# EAGLE schematic pe02 (EAGLE 9.6.2)
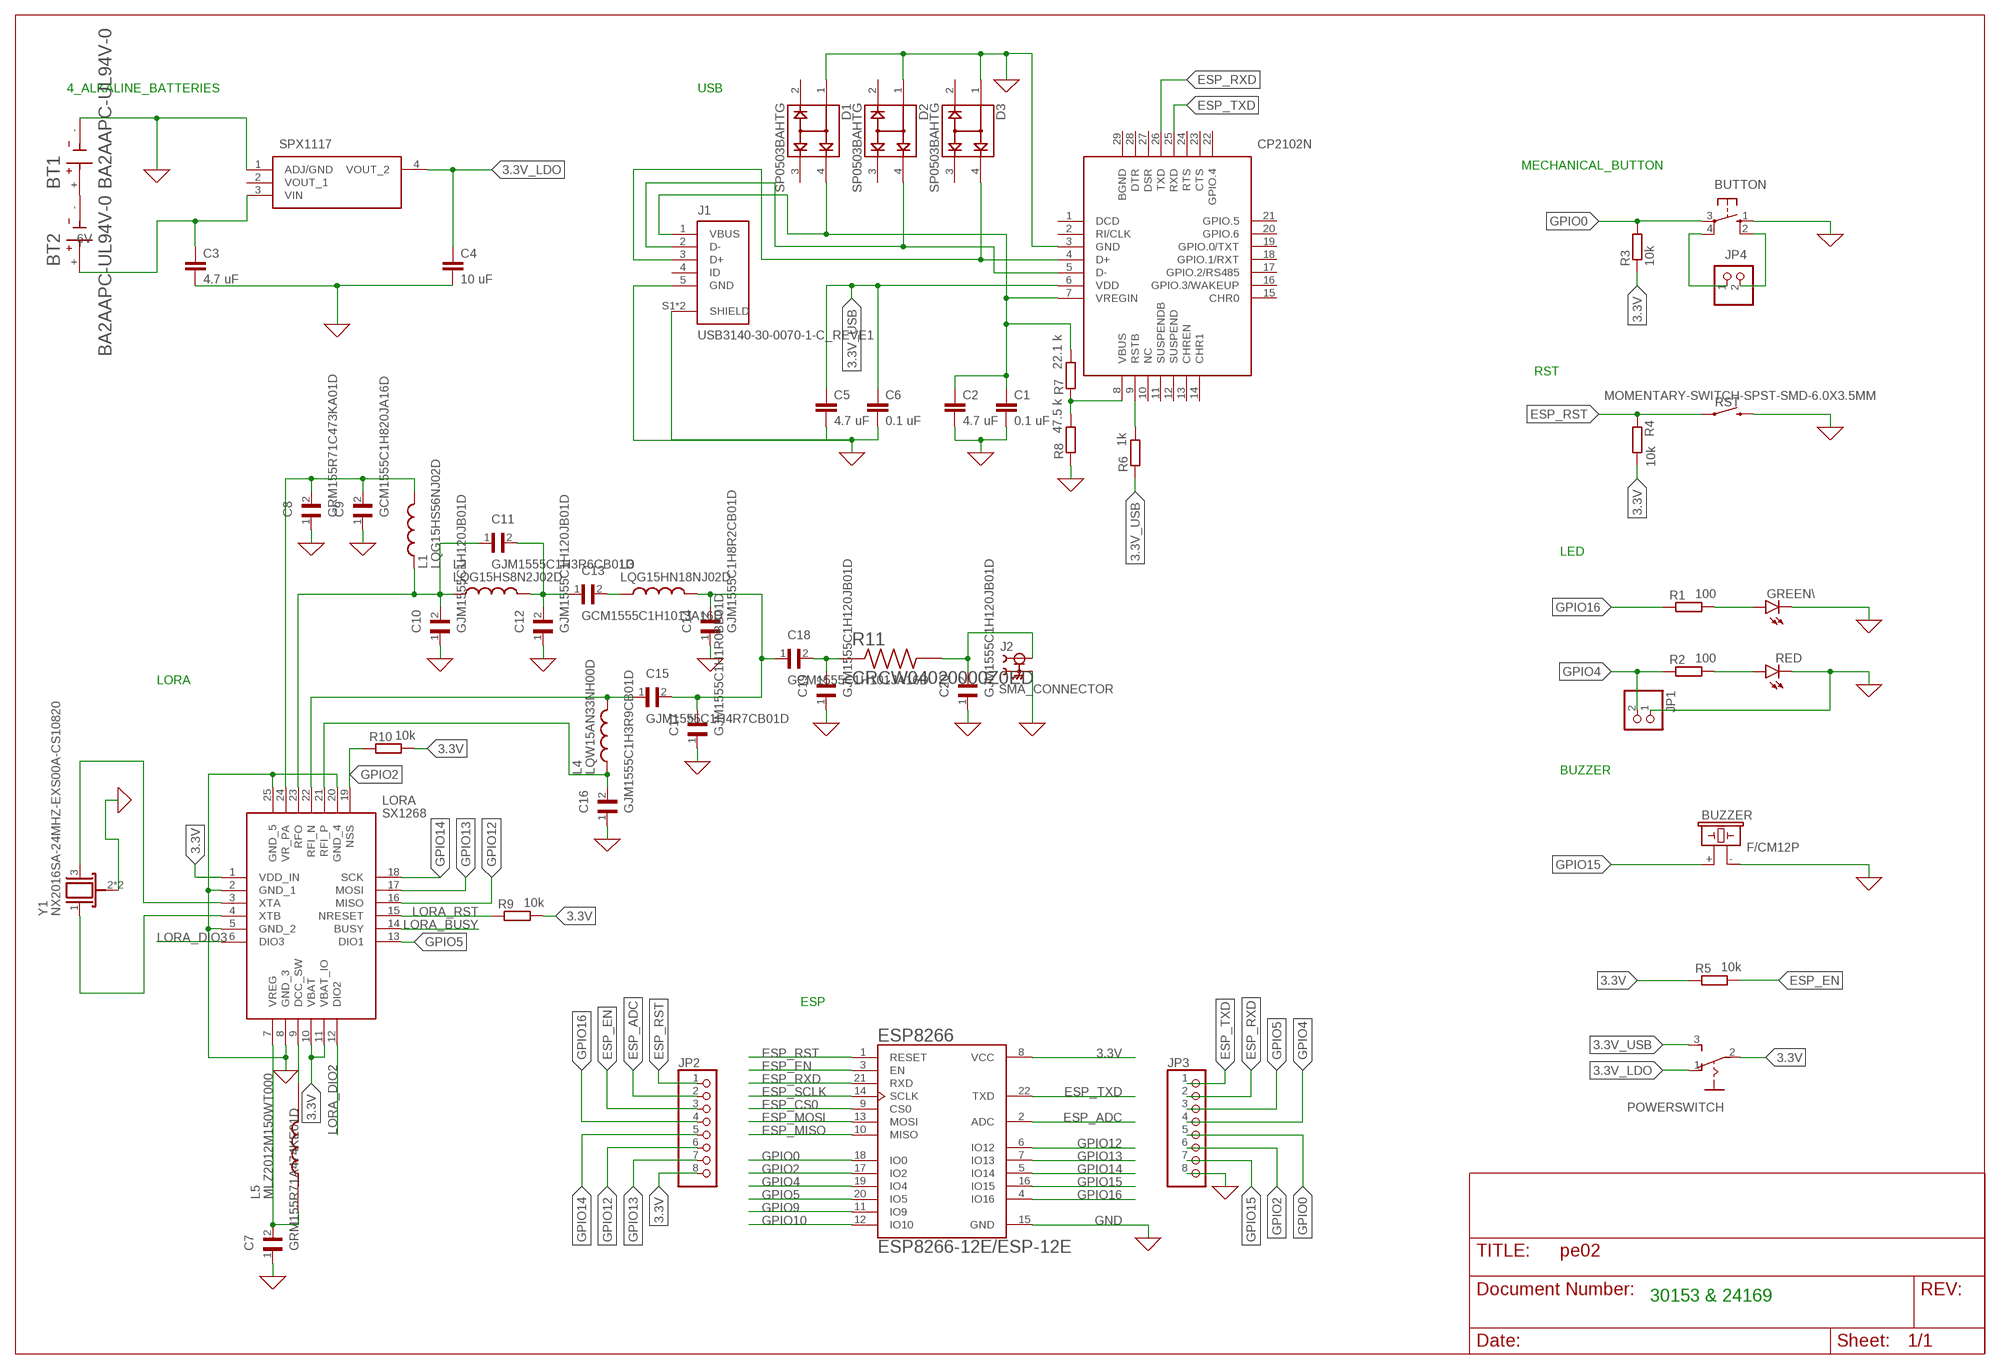
[diagram p0: schematic, sheet 1]

## Parts
BT1  BA2AAPC-UL94V-0  [BAT_BA2AAPC-UL94V-0]
BT2  BA2AAPC-UL94V-0  [BAT_BA2AAPC-UL94V-0]
BUTTON  10-XX  [B3F-10XX]
BUZZER  F/CM12P  [F/CM12P]
C1  0.1 uF  C-EUC1206K  [C1206K]
C2  4.7 uF  C-EUC1206K  [C1206K]
C3  4.7 uF  C-EUC1206K  [C1206K]
C4  10 uF  C-EUC1206K  [C1206K]
C5  4.7 uF  C-EUC1206K  [C1206K]
C6  0.1 uF  C-EUC1206K  [C1206K]
C7  GRM155R71A474KE01D  [CAPC1005X55N]
C8  GRM155R71C473KA01D  [CAPC1005X55N]
C9  GCM1555C1H820JA16D  [CAPC1005X55N]
C10  GJM1555C1H120JB01D  [CAPC1005X55N]
C11  GJM1555C1H3R6CB01D  [CAPC1005X55N]
C12  GJM1555C1H120JB01D  [CAPC1005X55N]
C13  GCM1555C1H101JA16D  [CAPC1005X55N]
C14  GJM1555C1H8R2CB01D  [CAPC1005X55N]
C15  GJM1555C1H4R7CB01D  [CAPC1005X55N]
C16  GJM1555C1H3R9CB01D  [CAPC1005X55N]
C17  GJM1555C1H1R0BB01D  [CAPC1005X55N]
C18  GCM1555C1H101JA16D  [CAPC1005X55N]
C19  GJM1555C1H120JB01D  [CAPC1005X55N]
C20  GJM1555C1H120JB01D  [CAPC1005X55N]
CP2102N  CP2102N-A02-GQFN28  [QFN50P500X500X80-29N]
D1  SP0503BAHTG  [SOT143]
D2  SP0503BAHTG  [SOT143]
D3  SP0503BAHTG  [SOT143]
ESP8266  ESP8266-12E/ESP-12E  [XCVR_ESP8266-12E/ESP-12E]
GREEN\  LEDCHIPLED_1206  [CHIPLED_1206]
J1  USB3140-30-0070-1-C_REVE1  [GCT_USB3140-30-0070-1-C_REVE1]
J2  SMA_CONNECTOR  [LPRS_SMA_CONNECTOR]
JP1  PINHD-1X2  [1X02]
JP2  PINHD-1X8  [1X08]
JP3  PINHD-1X8  [1X08]
JP4  PINHD-1X2  [1X02]
L1  LQG15HS56NJ02D  [INDC1005X55N]
L2  LQG15HS8N2J02D  [INDC1005X55N]
L3  LQG15HN18NJ02D  [INDC1005X55N]
L4  LQW15AN33NH00D  [INDC1005X60N]
L5  MLZ2012M150WT000  [INDC2012X145N]
LORA  SX1268  [QFN50P400X400X100-25N]
POWERSWITCH  255SB  [255SB]
R1  100  R-EU_R1206  [R1206]
R2  100  R-EU_R1206  [R1206]
R3  10k  R-EU_R1206  [R1206]
R4  10k  R-EU_R1206  [R1206]
R5  10k  R-EU_R1206  [R1206]
R6  1k  R-EU_R1206  [R1206]
R7  22.1 k  R-EU_R1206  [R1206]
R8  47.5 k  R-EU_R1206  [R1206]
R9  10k  R-EU_R1206  [R1206]
R10  10k  R-EU_R1206  [R1206]
R11  CRCW04020000Z0ED  [RESC1005X40N]
RED  LEDCHIPLED_1206  [CHIPLED_1206]
RST  MOMENTARY-SWITCH-SPST-SMD-6.0X3.5MM  [TACTILE_SWITCH_SMD_6.0X3.5MM]
SPX1117  SPX1117M3-L-3-3_TR  [SOT230P700X180-4N]
Y1  NX2016SA-24MHZ-EXS00A-CS10820  [OSC_NX2016SA-24MHZ-EXS00A-CS10820]

## Nets
3.3V [random]: ESP8266.8(VCC) JP2.8 LORA.1(VDD_IN) LORA.10(VBAT) LORA.11(VBAT_IO) POWERSWITCH.2(P) R3.1 R4.2 R5.1 R9.2 R10.2
3.3V_LDO [random]: C4.1 POWERSWITCH.1(O) SPX1117.4(VOUT_2)
3.3V_USB [random]: C5.1 C6.1 CP2102N.6(VDD) POWERSWITCH.3(S) R6.1
6V [random]: BT2.+ C3.1 SPX1117.3(VIN)
ESP_ADC [random]: ESP8266.2(ADC) JP2.2
ESP_CS0 [random]: ESP8266.9(CS0)
ESP_EN [random]: ESP8266.3(EN) JP2.3 R5.2
ESP_MISO [random]: ESP8266.10(MISO)
ESP_MOSI [random]: ESP8266.13(MOSI)
ESP_RST [random]: ESP8266.1(RESET) JP2.1 R4.1 RST.1
ESP_RXD [random]: CP2102N.26(TXD) ESP8266.21(RXD) JP3.2
ESP_SCLK [random]: ESP8266.14(SCLK)
ESP_TXD [random]: CP2102N.25(RXD) ESP8266.22(TXD) JP3.1
GND [random]: BT1.- BUTTON.1(S) BUZZER.- C1.2 C2.2 C3.2 C4.2 C5.2 C6.2 C7.1 C8.1 C9.1 C10.1 C12.1 C14.1 C16.1 C17.1 C19.1 C20.1 CP2102N.3(GND) D1.1 D2.1 D3.1 ESP8266.15(GND) GREEN\.C J1.5(GND) J1.S1(SHIELD) J1.S2(SHIELD) J2.G1 J2.G2 J2.G3 J2.G4 JP1.1 JP3.8 LORA.2(GND_1) LORA.5(GND_2) LORA.8(GND_3) LORA.20(GND_4) LORA.25(GND_5) R8.1 RED.C RST.2 SPX1117.1(ADJ/GND) Y1.2(GND) Y1.4(GND)
GPIO0 [random]: BUTTON.3(P) ESP8266.18(IO0) JP3.5 R3.2
GPIO2 [random]: ESP8266.17(IO2) JP3.6 LORA.19(NSS) R10.1
GPIO4 [random]: ESP8266.19(IO4) JP1.2 JP3.4 R2.1
GPIO5 [random]: ESP8266.20(IO5) JP3.3 LORA.13(DIO1)
GPIO9 [random]: ESP8266.11(IO9)
GPIO10 [random]: ESP8266.12(IO10)
GPIO12 [random]: ESP8266.6(IO12) JP2.6 LORA.16(MISO)
GPIO13 [random]: ESP8266.7(IO13) JP2.7 LORA.17(MOSI)
GPIO14 [random]: ESP8266.5(IO14) JP2.5 LORA.18(SCK)
GPIO15 [random]: BUZZER.+ ESP8266.16(IO15) JP3.7
GPIO16 [random]: ESP8266.4(IO16) JP2.4 R1.1
LORA_BUSY [random]: LORA.14(BUSY)
LORA_DIO2 [random]: LORA.12(DIO2)
LORA_DIO3 [random]: LORA.6(DIO3)
LORA_RFI_N [random]: C15.1 L4.2 LORA.22(RFI_N)
LORA_RFI_P [random]: C16.2 L4.1 LORA.21(RFI_P)
LORA_RFO [random]: C10.2 C11.1 L1.1 L2.1 LORA.23(RFO)
LORA_RST [random]: LORA.15(NRESET) R9.1
LORA_VR_PA [random]: C8.2 C9.2 L1.2 LORA.24(VR_PA)
LORA_XTA [random]: LORA.3(XTA) Y1.3
LORA_XTB [random]: LORA.4(XTB) Y1.1
N$1 [random]: BUTTON.4(P1) JP4.1
N$2 [random]: BUTTON.2(S1) JP4.2
N$3 [random]: C7.2 L5.1 LORA.7(VREG)
N$4 [random]: L5.2 LORA.9(DCC_SW)
N$5 [random]: CP2102N.5(D-) D2.4 J1.2(D-)
N$6 [random]: C13.2 L3.1
N$7 [random]: GREEN\.A R1.2
N$8 [random]: R2.2 RED.A
N$9 [random]: C11.2 C12.2 C13.1 L2.2
N$10 [random]: BT1.+ BT2.-
N$12 [random]: C14.2 C15.2 C17.2 C18.1 L3.2
N$13 [random]: C20.2 J2.1 R11.2
N$15 [random]: C18.2 C19.2 R11.1
N$34 [random]: CP2102N.4(D+) D3.4 J1.3(D+)
N$39 [random]: CP2102N.9(RSTB) R6.2
N$40 [random]: CP2102N.8(VBUS) R7.1 R8.2
N$42 [random]: C1.1 C2.1 CP2102N.7(VREGIN) D1.4 J1.1(VBUS) R7.2
Unconnected: CP2102N.1(DCD) CP2102N.2(RI/CLK) CP2102N.10(NC) CP2102N.11(SUSPENDB) CP2102N.12(SUSPEND) CP2102N.13(CHREN) CP2102N.14(CHR1) CP2102N.15(CHR0) CP2102N.16(GPIO.3/WAKEUP) CP2102N.17(GPIO.2/RS485) CP2102N.18(GPIO.1/RXT) CP2102N.19(GPIO.0/TXT) CP2102N.20(GPIO.6) CP2102N.21(GPIO.5) CP2102N.22(GPIO.4) CP2102N.23(CTS) CP2102N.24(RTS) CP2102N.27(DSR) CP2102N.28(DTR) D1.2 D1.3 D2.2 D2.3 D3.2 D3.3 J1.4(ID) SPX1117.2(VOUT_1)

## Notes on the sheet
- 4_ALKALINE_BATTERIES | USB
- MECHANICAL_BUTTON
- RST
- LED
- LORA
- BUZZER
- ESP
- 30153 & 24169

## Power pins joined to a net without a drawn wire
BGND: CP2102N.29(BGND)

## Library data of the parts
BT1 BT2 = BA2AAPC-UL94V-0:BA2AAPC-UL94V-0: 2 AA cell holder w/ PC pins springless Check availability <https://pricing.snapeda.com/parts/BA2AAPC-UL94V-0/MPD/view-part?ref=eda>; AVAILABILITY: In Stock; CHECK_PRICES: https://www.snapeda.com/parts/BA2AAPC-UL94V-0/MPD/view-part/?ref=eda; DESCRIPTION: BATTERY HOLDER AA 2 CELL SMD TAB; MF: MPD; MP: BA2AAPC-UL94V-0; PACKAGE: None; PRICE: None; SNAPEDA_LINK: https://www.snapeda.com/parts/BA2AAPC-UL94V-0/MPD/view-part/?ref=snap
BUTTON = switch-omron:10-XX: OMRON SWITCH; MPN: B3F-1000; OC_FARNELL: 176432; OC_NEWARK: 36M3542
BUZZER = buzzer:F/CM12P: BUZZER Source: Buerklin; OC_FARNELL: unknown; OC_NEWARK: unknown
C1-C6 = rcl:C-EU: CAPACITOR, European symbol; SPICEPREFIX: C
C7 = GRM155R71A474KE01D:GRM155R71A474KE01D: SMD Capacitor X7R(EIA) with Capacitance: 0.47uF Tol. 10%. Rated Voltage: 10Vdc Check availability <https://pricing.snapeda.com/parts/GRM155R71A474KE01D/Murata/view-part?ref=eda>; AVAILABILITY: In Stock; CHECK_PRICES: https://www.snapeda.com/parts/GRM155R71A474KE01D/Murata+Electronics+North+America/view-part/?ref=eda; DESCRIPTION: SMD capacitor X7R(EIA) with capacitance 0.47uF Tol.10%. Rated voltage 10Vdc 125C; MF: Murata; MP: GRM155R71A474KE01D; PACKAGE: 1005-2 Murata; PRICE: None; SNAPEDA_LINK: https://www.snapeda.com/parts/GRM155R71A474KE01D/Murata+Electronics+North+America/view-part/?ref=snap
C8 = GRM155R71C473KA01D:GRM155R71C473KA01D: SMD Capacitor X7R(EIA) with Capacitance: 47000pF Tol. 10%. Rated Voltage: 16Vdc Check availability <https://pricing.snapeda.com/parts/GRM155R71C473KA01D/Murata/view-part?ref=eda>; AVAILABILITY: In Stock; CHECK_PRICES: https://www.snapeda.com/parts/GRM155R71C473KA01D/Murata+Electronics+North+America/view-part/?ref=eda; DESCRIPTION: SMD capacitor X7R(EIA) with capacitance 47000pF Tol.10%. Rated voltage 16Vdc 125C; MF: Murata; MP: GRM155R71C473KA01D; PACKAGE: 1005-2 Murata; PRICE: None; SNAPEDA_LINK: https://www.snapeda.com/parts/GRM155R71C473KA01D/Murata+Electronics+North+America/view-part/?ref=snap
C9 = GCM1555C1H820JA16D:GCM1555C1H820JA16D: Check availability <https://pricing.snapeda.com/parts/GCM1555C1H820JA16D/Murata%20Electronics/view-part?ref=eda>; AVAILABILITY: In Stock; CHECK_PRICES: https://www.snapeda.com/parts/GCM1555C1H820JA16D/Murata+Electronics+North+America/view-part/?ref=eda; DESCRIPTION: Cap Ceramic 82pF 50V C0G 5% Pad SMD 0402 125C Automotive T/R; MF: Murata Electronics; MP: GCM1555C1H820JA16D; PACKAGE: 1005 Taiyo Yuden; PRICE: None; SNAPEDA_LINK: https://www.snapeda.com/parts/GCM1555C1H820JA16D/Murata+Electronics+North+America/view-part/?ref=snap
C10 C12 C19 C20 = GJM1555C1H120JB01D:GJM1555C1H120JB01D: Cap Ceramic 12pF 50V C0G 5% Pad SMD 0402 125C T/R Check availability <https://pricing.snapeda.com/parts/GJM1555C1H120JB01D/Murata/view-part?ref=eda>; AVAILABILITY: In Stock; CHECK_PRICES: https://www.snapeda.com/parts/GJM1555C1H120JB01D/Murata+Electronics+North+America/view-part/?ref=eda; DESCRIPTION: 12 pF ±5% 50V Ceramic Capacitor C0G, NP0 0402 (1005 Metric); MF: Murata; MP: GJM1555C1H120JB01D; PACKAGE: 1005 Taiyo Yuden; PRICE: None; SNAPEDA_LINK: https://www.snapeda.com/parts/GJM1555C1H120JB01D/Murata+Electronics+North+America/view-part/?ref=snap
C11 = GJM1555C1H3R6CB01D:GJM1555C1H3R6CB01D: Check availability <https://pricing.snapeda.com/parts/GJM1555C1H3R6CB01D/Murata/view-part?ref=eda>; AVAILABILITY: In Stock; CHECK_PRICES: https://www.snapeda.com/parts/GJM1555C1H3R6CB01D/Murata+Electronics+North+America/view-part/?ref=eda; DESCRIPTION: 0402 3.6 pF 50 V ±0.25 pF Tolerance C0G/NP0 Multilayer Ceramic Capacitor; MF: Murata; MP: GJM1555C1H3R6CB01D; PACKAGE: 1005 Taiyo Yuden; PRICE: None; SNAPEDA_LINK: https://www.snapeda.com/parts/GJM1555C1H3R6CB01D/Murata+Electronics+North+America/view-part/?ref=snap
C13 C18 = GCM1555C1H101JA16D:GCM1555C1H101JA16D: Cap Ceramic 100pF 50V C0G 5% SMD 0402 125°C Paper T/R Check availability <https://pricing.snapeda.com/parts/GCM1555C1H101JA16D/Murata%20Electronics/view-part?ref=eda>; AVAILABILITY: In Stock; CHECK_PRICES: https://www.snapeda.com/parts/GCM1555C1H101JA16D/Murata+Electronics+North+America/view-part/?ref=eda; DESCRIPTION: SMD Multilayer Ceramic Capacitor, GCM Series, 100 pF, 5%, C0G / NP0, 50 V, 0402 [1005 Metric]; MF: Murata Electronics; MP: GCM1555C1H101JA16D; PACKAGE: 1005 Taiyo Yuden; PRICE: None; SNAPEDA_LINK: https://www.snapeda.com/parts/GCM1555C1H101JA16D/Murata+Electronics+North+America/view-part/?ref=snap
C14 = GJM1555C1H8R2CB01D:GJM1555C1H8R2CB01D: Cap Ceramic 8.2pF 50V C0G 0.25pF Pad SMD 0402 125°C T/R Check availability <https://pricing.snapeda.com/parts/GJM1555C1H8R2CB01D/Murata/view-part?ref=eda>; AVAILABILITY: In Stock; CHECK_PRICES: https://www.snapeda.com/parts/GJM1555C1H8R2CB01D/Murata+Electronics+North+America/view-part/?ref=eda; DESCRIPTION: 8.2 pF ±0.25pF 50V Ceramic Capacitor C0G, NP0 0402 (1005 Metric); MF: Murata; MP: GJM1555C1H8R2CB01D; PACKAGE: 1005 Taiyo Yuden; PRICE: None; SNAPEDA_LINK: https://www.snapeda.com/parts/GJM1555C1H8R2CB01D/Murata+Electronics+North+America/view-part/?ref=snap
C15 = GJM1555C1H4R7CB01D:GJM1555C1H4R7CB01D: Check availability <https://pricing.snapeda.com/parts/GJM1555C1H4R7CB01D/Murata/view-part?ref=eda>; AVAILABILITY: In Stock; CHECK_PRICES: https://www.snapeda.com/parts/GJM1555C1H4R7CB01D/Murata+Electronics+North+America/view-part/?ref=eda; DESCRIPTION: 0402 4.7pF 50V ±0.25 pF Tolerance C0G SMT Multilayer Ceramic Capacitor; MF: Murata; MP: GJM1555C1H4R7CB01D; PACKAGE: 1005 Taiyo Yuden; PRICE: None; SNAPEDA_LINK: https://www.snapeda.com/parts/GJM1555C1H4R7CB01D/Murata+Electronics+North+America/view-part/?ref=snap
C16 = GJM1555C1H3R9CB01D:GJM1555C1H3R9CB01D: Check availability <https://pricing.snapeda.com/parts/GJM1555C1H3R9CB01D/Murata/view-part?ref=eda>; AVAILABILITY: In Stock; CHECK_PRICES: https://www.snapeda.com/parts/GJM1555C1H3R9CB01D/Murata+Electronics+North+America/view-part/?ref=eda; DESCRIPTION: 0402 3.9 pF 50V ±0.25 pF Tolerance C0G SMT Multilayer Ceramic Capacitor; MF: Murata; MP: GJM1555C1H3R9CB01D; PACKAGE: 1005 Taiyo Yuden; PRICE: None; SNAPEDA_LINK: https://www.snapeda.com/parts/GJM1555C1H3R9CB01D/Murata+Electronics+North+America/view-part/?ref=snap
C17 = GJM1555C1H1R0BB01D:GJM1555C1H1R0BB01D: Check availability <https://pricing.snapeda.com/parts/GJM1555C1H1R0BB01D/Murata/view-part?ref=eda>; AVAILABILITY: In Stock; CHECK_PRICES: https://www.snapeda.com/parts/GJM1555C1H1R0BB01D/Murata+Electronics+North+America/view-part/?ref=eda; DESCRIPTION: 0402 1 pF 50 V ±0.1 pF Tolerance C0G SMT Multilayer Ceramic Capacitor; MF: Murata; MP: GJM1555C1H1R0BB01D; PACKAGE: 1005 Taiyo Yuden; PRICE: None; SNAPEDA_LINK: https://www.snapeda.com/parts/GJM1555C1H1R0BB01D/Murata+Electronics+North+America/view-part/?ref=snap
CP2102N = CP2102N-A02-GQFN28:CP2102N-A02-GQFN28: SILICON LABS - CP2102N-A02-GQFN28 - USB TO UART BRIDGE, -40 TO 85DEG C Source: Datasheet <https://componentsearchengine.com/Datasheets/2/CP2102N-A02-GQFN28.pdf>; DESCRIPTION: SILICON LABS - CP2102N-A02-GQFN28 - USB TO UART BRIDGE, -40 TO 85DEG C; HEIGHT: 0.8mm; MANUFACTURER_NAME: Silicon Labs; MANUFACTURER_PART_NUMBER: CP2102N-A02-GQFN28; MOUSER_PART_NUMBER: 634-CP2102NA02GQFN28; MOUSER_PRICE-STOCK: https://www.mouser.co.uk/ProductDetail/Silicon-Labs/CP2102N-A02-GQFN28?qs=u16ybLDytRaSBkSkyjYFiA%3D%3D
D1-D3 = SP0503BAHTG:SP0503BAHTG: TVS DIODE 5.5VWM 8.5VC SOT143 Check availability <https://pricing.snapeda.com/parts/SP0503BAHTG/Littelfuse%20Inc./view-part?ref=eda>; AVAILABILITY: In Stock; CHECK_PRICES: https://www.snapeda.com/parts/SP0503BAHTG/Littelfuse+Inc./view-part/?ref=eda; DESCRIPTION: 8.5V Clamp - Ipp Tvs Diode Surface Mount SOT-143-4; MF: Littelfuse Inc.; MP: SP0503BAHTG; PACKAGE: SOT-143 Littelfuse; PRICE: None; SNAPEDA_LINK: https://www.snapeda.com/parts/SP0503BAHTG/Littelfuse+Inc./view-part/?ref=snap
ESP8266 = ESP8266-12E_ESP-12E:ESP8266-12E/ESP-12E: ESP-12E WiFi Module Check availability <https://pricing.snapeda.com/parts/ESP8266-12E/ESP-12E/AI-Thinker/view-part?ref=eda>; AVAILABILITY: Not in stock; CHECK_PRICES: https://www.snapeda.com/parts/ESP8266-12E/ESP-12E/AI-Thinker/view-part/?ref=eda; DESCRIPTION: This WiFi module has a 32-bit MCU micro and clock speeds supporting 80 MHz or 160 MHz. Supports the RTOS and integrated Wi-Fi MAC/BB/RF/PA/LNA, and has an on-board antenna.; MF: AI-Thinker; MP: ESP8266-12E/ESP-12E; PACKAGE: None; PRICE: None; SNAPEDA_LINK: https://www.snapeda.com/parts/ESP8266-12E/ESP-12E/AI-Thinker/view-part/?ref=snap
GREEN\ RED = led:LED: LED OSRAM: - CHIPLED LG R971, LG N971, LY N971, LG Q971, LY Q971, LO R971, LY R971 LH N974, LH R974 LS Q976, LO Q976, LY Q976 LO Q996 - Hyper CHIPLED LW Q18S LB Q993, LB Q99A, LB R99A - SideLED LS A670, LO A670, LY A670, LG A670, LP A670 LB A673, LV A673, LT A673, LW A673 LH A674 LY A675 LS A676, LA A676, LO A676, LY A676, LW A676 LS A679, LY A679, LG A679 - Hyper Micro SIDELED® LS Y876, LA Y876, LO Y876, LY Y876 LT Y87S - SmartLED LW L88C, LW L88S LB L89C, LB L89S, LG L890 LS L89K, LO L89K, LY L89K LS L896, LA L896, LO L896, LY L896 - TOPLED LS T670, LO T670, LY T670, LG T670, LP T670 LSG T670, LSP T670, LSY T670, LOP T670, LYG T670 LG T671, LOG T671, LSG T671 LB T673, LV T673, LT T673, LW T673 LH T674 LS T676, LA T676, LO T676, LY T676, LB T676, LH T676, LSB T676, LW T676 LB T67C, LV T67C, LT T67C, LS T67K, LO T67K, LY T67K, LW E67C LS E67B, LA E67B, LO E67B, LY E67B, LB E67C, LV E67C, LT E67C LW T67C LS T679, LY T679, LG T679 LS T770, LO T770, LY T770, LG T770, LP T770 LB T773, LV T773, LT T773, LW T773 LH T774 LS E675, LA E675, LY E675, LS T675 LS T776, LA T776, LO T776, LY T776, LB T776 LHGB T686 LT T68C, LB T68C - Hyper Mini TOPLED® LB M676 - Mini TOPLED Santana® LG M470 LS M47K, LO M47K, LY M47K Source: http://www.osram.convergy.de LUXEON: - LUMILED® LXK2-PW12-R00, LXK2-PW12-S00, LXK2-PW14-U00, LXK2-PW14-V00 LXK2-PM12-R00, LXK2-PM12-S00, LXK2-PM14-U00 LXK2-PE12-Q00, LXK2-PE12-R00, LXK2-PE12-S00, LXK2-PE14-T00, LXK2-PE14-U00 LXK2-PB12-K00, LXK2-PB12-L00, LXK2-PB12-M00, LXK2-PB14-N00, LXK2-PB14-P00, LXK2-PB14-Q00 LXK2-PR12-L00, LXK2-PR12-M00, LXK2-PR14-Q00, LXK2-PR14-R00 LXK2-PD12-Q00, LXK2-PD12-R00, LXK2-PD12-S00 LXK2-PH12-R00, LXK2-PH12-S00 LXK2-PL12-P00, LXK2-PL12-Q00, LXK2-PL12-R00 Source: www.luxeon.com KINGBRIGHT: KA-3528ASYC Source: www.kingbright.com
J1 = USB3140-30-0070-1-C_REVE1:USB3140-30-0070-1-C_REVE1: USB - micro B USB 2.0 Receptacle Connector 5 Position Surface Mount Check availability <https://pricing.snapeda.com/parts/USB3140-30-0070-1-C/Global%20Connector%20Technology/view-part?ref=eda>; AVAILABILITY: In Stock; CHECK_PRICES: https://www.snapeda.com/parts/USB3140-30-0070-1-C/Global+Connector+Technology/view-part/?ref=eda; DESCRIPTION: USB - micro B USB 2.0 Receptacle Connector 5 Position Surface Mount, Through Hole; MF: Global Connector Technology; MP: USB3140-30-0070-1-C; PACKAGE: None; PRICE: None; SNAPEDA_LINK: https://www.snapeda.com/parts/USB3140-30-0070-1-C/Global+Connector+Technology/view-part/?ref=snap
J2 = SMA_CONNECTOR:SMA_CONNECTOR: Straight SMA Connector Check availability <https://pricing.snapeda.com/parts/SMA%20CONNECTOR/LPRS/view-part?ref=eda>; AVAILABILITY: In Stock; CHECK_PRICES: https://www.snapeda.com/parts/SMA%20CONNECTOR/LPRS/view-part/?ref=eda; DESCRIPTION: RF Coaxial Straight SMA Connector; MF: LPRS; MP: SMA CONNECTOR; PACKAGE: None; PRICE: None; PURCHASE-URL: https://www.snapeda.com/api/url_track_click_mouser/?unipart_id=4703486&manufacturer=LPRS&part_name=SMA CONNECTOR&search_term=None; SNAPEDA_LINK: https://www.snapeda.com/parts/SMA%20CONNECTOR/LPRS/view-part/?ref=snap
JP1 JP4 = pinhead:PINHD-1X2: PIN HEADER
JP2 JP3 = pinhead:PINHD-1X8: PIN HEADER
L1 = LQG15HS56NJ02D:LQG15HS56NJ02D: LQG Series 0402 56 nH ±5 % Tol. 200 mA SMT High Frequency Multilayer Inductor Check availability <https://pricing.snapeda.com/parts/LQG15HS56NJ02D/Murata/view-part?ref=eda>; AVAILABILITY: In Stock; CHECK_PRICES: https://www.snapeda.com/parts/LQG15HS56NJ02D/Murata+Electronics+North+America/view-part/?ref=eda; DESCRIPTION: Inductor with Inductance: 56nH Tol. +/-5%, Package: 0402 (1005); MF: Murata; MP: LQG15HS56NJ02D; PACKAGE: 1005 Murata; PRICE: None; SNAPEDA_LINK: https://www.snapeda.com/parts/LQG15HS56NJ02D/Murata+Electronics+North+America/view-part/?ref=snap
L2 = LQG15HS8N2J02D:LQG15HS8N2J02D: Ind RF Chip Multi-Layer 8.2nH 5% 100MHz 8Q-Factor Air 300mA 0402 Paper T/R Check availability <https://pricing.snapeda.com/parts/LQG15HS8N2J02D/Murata/view-part?ref=eda>; AVAILABILITY: In Stock; CHECK_PRICES: https://www.snapeda.com/parts/LQG15HS8N2J02D/Murata+Electronics+North+America/view-part/?ref=eda; DESCRIPTION: Inductor with Inductance: 8.2nH Tol. +/-5%, Package: 0402 (1005); MF: Murata; MP: LQG15HS8N2J02D; PACKAGE: 1005 Murata; PRICE: None; SNAPEDA_LINK: https://www.snapeda.com/parts/LQG15HS8N2J02D/Murata+Electronics+North+America/view-part/?ref=snap
L3 = LQG15HN18NJ02D:LQG15HN18NJ02D: INDUCTOR, 0402 CASE, 18NH±5%; Inductor Type:Monolithic; Inductance:18nH; Tolerance, Inductance:± 5%; Resistance:0.51ohm; DC Current Max:300mA; Self Resonant Frequency:2100MHz; Case Style:0402; Q Factor @ Vr, F:8; Tolerance, +:5%; Tolerance, -:5%; Inductance Measurement Frequency:100MHz; Q Factor Frequency:100MHz; Temp, Op. Max:125°C; Temp, Op. Min:-55°C Check availability <https://pricing.snapeda.com/parts/LQG15HN18NJ02D/Murata/view-part?ref=eda>; AVAILABILITY: In Stock; CHECK_PRICES: https://www.snapeda.com/parts/LQG15HN18NJ02D/Murata+Electronics+North+America/view-part/?ref=eda; DESCRIPTION: Inductor with Inductance: 18nH Tol. +/-5%, Package: 0402 (1005); MF: Murata; MP: LQG15HN18NJ02D; PACKAGE: 1005 Murata; PRICE: None; SNAPEDA_LINK: https://www.snapeda.com/parts/LQG15HN18NJ02D/Murata+Electronics+North+America/view-part/?ref=snap
L4 = LQW15AN33NH00D:LQW15AN33NH00D: Inductor SMD 0402 33nH Check availability <https://pricing.snapeda.com/parts/LQW15AN33NH00D/Murata/view-part?ref=eda>; AVAILABILITY: In Stock; CHECK_PRICES: https://www.snapeda.com/parts/LQW15AN33NH00D/Murata+Electronics+North+America/view-part/?ref=eda; DESCRIPTION: Inductor with Inductance: 33nH Tol. +/-3%, Package: 0402 (1005); MF: Murata; MP: LQW15AN33NH00D; PACKAGE: 1005 Murata; PRICE: None; SNAPEDA_LINK: https://www.snapeda.com/parts/LQW15AN33NH00D/Murata+Electronics+North+America/view-part/?ref=snap
L5 = MLZ2012M150WT000:MLZ2012M150WT000: 15µH Shielded Multilayer Inductor 250mA 950mOhm 0805 (2012 Metric) Check availability <https://pricing.snapeda.com/parts/MLZ2012M150WT000/TDK%20Corporation/view-part?ref=eda>; AVAILABILITY: In Stock; CHECK_PRICES: https://www.snapeda.com/parts/MLZ2012M150WT000/TDK/view-part/?ref=eda; DESCRIPTION: Inductor Power Shielded Multi-Layer 15uH 20% 2MHz Ferrite 0.25A 1.235Ohm DCR 0805 T/R; MF: TDK Corporation; MP: MLZ2012M150WT000; PACKAGE: None; PRICE: None; SNAPEDA_LINK: https://www.snapeda.com/parts/MLZ2012M150WT000/TDK/view-part/?ref=snap
LORA = SX1268:SX1268: LoRa Connect Long Range Low Power LoRa Transceiver +22dBm, China frequency bands Source: Datasheet <https://semtech.my.salesforce.com/sfc/p/E0000000JelG/a/2R000000HTIE/.wr7MYcDJegmsXUflvtVGp7PiqAzdCaqRKXqRr3J8Y4>; DESCRIPTION: LoRa Connect Long Range Low Power LoRa Transceiver +22dBm, China frequency bands; HEIGHT: 1mm; MANUFACTURER_NAME: SEMTECH; MANUFACTURER_PART_NUMBER: SX1268
POWERSWITCH = switch:255SB: SLIDING SWITCH Distributor Buerklin, 11G810
R1-R10 = rcl:R-EU_: RESISTOR, European symbol; SPICEPREFIX: R
R11 = CRCW04020000Z0ED:CRCW04020000Z0ED: RESISTOR, 0402, 0R, FULL REEL Check availability <https://pricing.snapeda.com/parts/CRCW04020000Z0ED/Vishay/view-part?ref=eda>; AVAILABILITY: In Stock; CHECK_PRICES: https://www.snapeda.com/parts/CRCW04020000Z0ED/Vishay+Dale/view-part/?ref=eda; DESCRIPTION: 0 Ohms Jumper 0.2W, 1/5W Chip Resistor 0402 (1005 Metric) Automotive AEC-Q200, Pulse Withstanding Thick Film; MF: Vishay; MP: CRCW04020000Z0ED; PACKAGE: 1005 Panasonic Electronic Components; PRICE: None; SNAPEDA_LINK: https://www.snapeda.com/parts/CRCW04020000Z0ED/Vishay+Dale/view-part/?ref=snap
RST = SparkFun-Switches:MOMENTARY-SWITCH-SPST: Momentary Switch (Pushbutton) - SPST Normally-open (NO) SPST momentary switches (buttons, pushbuttons). Variants PTH-12MM - 12mm square, through-hole Momentary Pushbutton Switch - 12mm Square <https://www.sparkfun.com/products/9190> (COM-09190) PTH-6.0MM, PTH-6.0MM-KIT - 6.0mm square, through-hole Mini Pushbutton Switch <https://www.sparkfun.com/products/97> (COM-00097) KIT package intended for soldering kit's - only one side of pads' copper is exposed. PTH-RIGHT-ANGLE-KIT - Right-angle, through-hole Right Angle Tactile Button <https://www.sparkfun.com/products/10791> - Used on SparkFun BigTime Watch Kit <https://www.sparkfun.com/products/11734> SMD-12MM - 12mm square, surface-mount Tactile Button - SMD (12mm) <https://www.sparkfun.com/products/12993> (COM-12993) Used on SparkFun PicoBoard <https://www.sparkfun.com/products/11888> SMD-4.5MM - 4.5mm Square Trackball Switch Used on SparkFun Blackberry Trackballer Breakout <https://www.sparkfun.com/products/13169> SMD-4.6MMX2.8MM - 4.60mm x 2.80mm, surface mount Used on SparkFun Pro Micro - RP2040 <https://www.sparkfun.com/products/17717> SMD-5.2MM, SMD-5.2-REDUNDANT - 5.2mm square, surface-mount Mini Pushbutton Switch - SMD <https://www.sparkfun.com/products/8720> (COM-08720) Used on Arduino Pro Mini <https://www.sparkfun.com/products/11114> REDUNDANT package connects both switch circuits together SMD-6.0X3.5MM - 6.0 x 3.5mm, surface mount Momentary Reset Switch SMD <https://www.sparkfun.com/products/8229> (COM-08229) SMD-6.2MM-TALL - 6.2mm square, surface mount Tactile Button - SMD (6mm) <https://www.sparkfun.com/products/12992> Used on SparkFun Digital Sandbox <https://www.sparkfun.com/products/12651> SMD-RIGHT-ANGLE - Right-angle, surface mount Used on SparkFun Block for Intel® Edison - Arduino <https://www.sparkfun.com/products/13036>; PROD_ID: SWCH-14278; SF_SKU: COM-08229
SPX1117 = SPX1117M3-L-3-3_TR:SPX1117M3-L-3-3_TR: LDO Regulator 3.3V 800mA 2.6-15V TO263-3 Source: Datasheet <https://componentsearchengine.com/Datasheets/2/SPX1117M3-L-3-3_TR.pdf>; ARROW_PART_NUMBER: SPX1117M3-L-3-3/TR; ARROW_PRICE-STOCK: https://www.arrow.com/en/products/spx1117m3-l-3-3tr/exar; DESCRIPTION: LDO Regulator 3.3V 800mA 2.6-15V TO263-3; HEIGHT: 1.8mm; MANUFACTURER_NAME: EXAR; MANUFACTURER_PART_NUMBER: SPX1117M3-L-3-3/TR; MOUSER_PART_NUMBER: 701-SPX1117M3-L-33TR; MOUSER_PRICE-STOCK: https://www.mouser.com/Search/Refine.aspx?Keyword=701-SPX1117M3-L-33TR
Y1 = NX2016SA-24MHZ-EXS00A-CS10820:NX2016SA-24MHZ-EXS00A-CS10820: 24MHz Crystal 6pF 80 Ohms 4-SMD, No Lead Check availability <https://pricing.snapeda.com/parts/NX2016SA-24MHZ-EXS00A-CS10820/NDK%20America%2C%20Inc./view-part?ref=eda>; AVAILABILITY: In Stock; CHECK_PRICES: https://www.snapeda.com/parts/NX2016SA-24MHZ-EXS00A-CS10820/NDK+America%252C+Inc./view-part/?ref=eda; DESCRIPTION: 24 MHz ±15ppm Crystal 8pF 80 Ohms 4-SMD, No Lead; MF: NDK America, Inc.; MP: NX2016SA-24MHZ-EXS00A-CS10820; PACKAGE: SMD-4 NDK America,; PRICE: None; SNAPEDA_LINK: https://www.snapeda.com/parts/NX2016SA-24MHZ-EXS00A-CS10820/NDK+America%252C+Inc./view-part/?ref=snap

## Net classes
0 default: width 0.8 mm
2 0.25: width 0.006 mm